# Altium schematic sheet RAMBo.SchDoc
size 553 x 388 mm; SheetNumber: 1
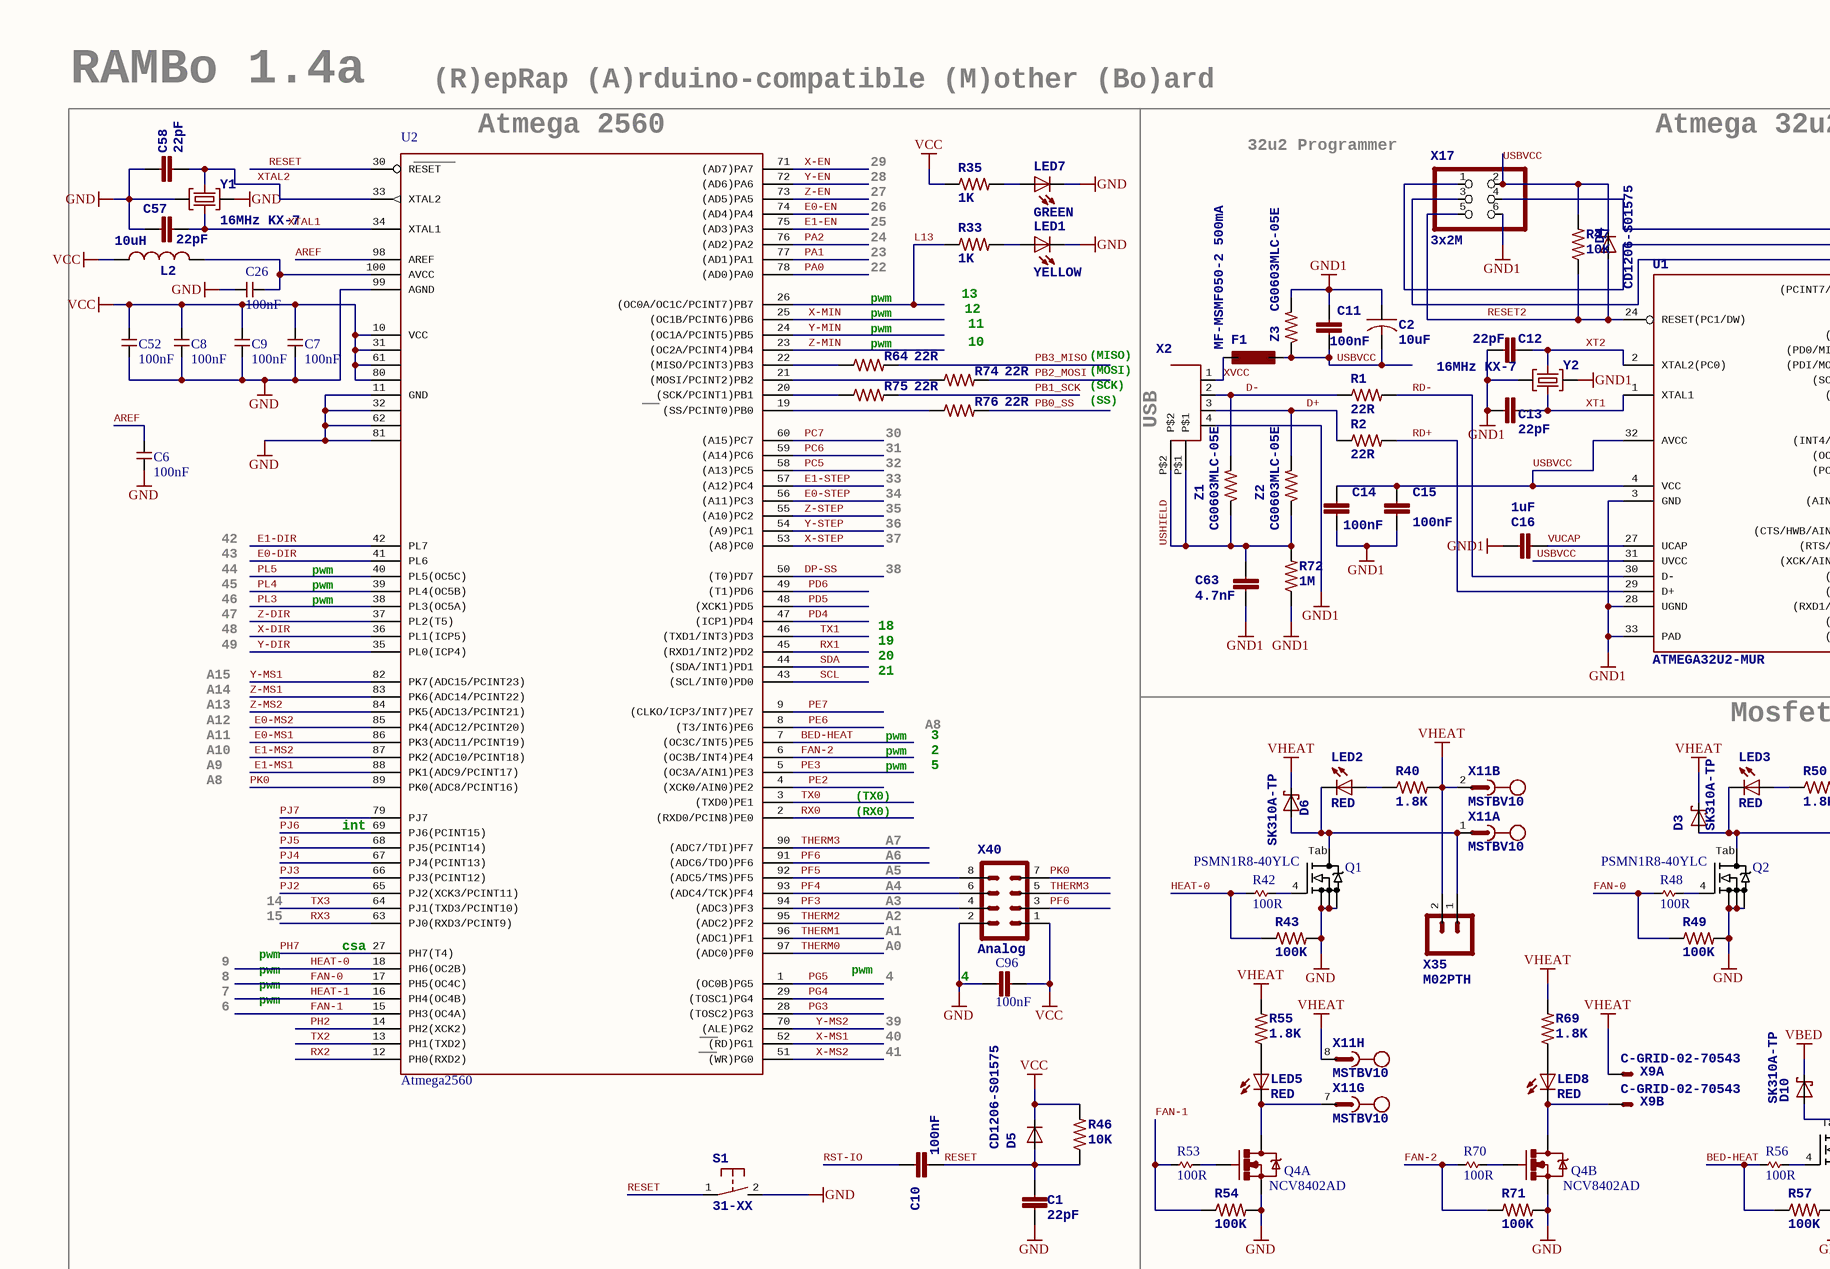
[diagram p0: RAMBo.SchDoc, top left]
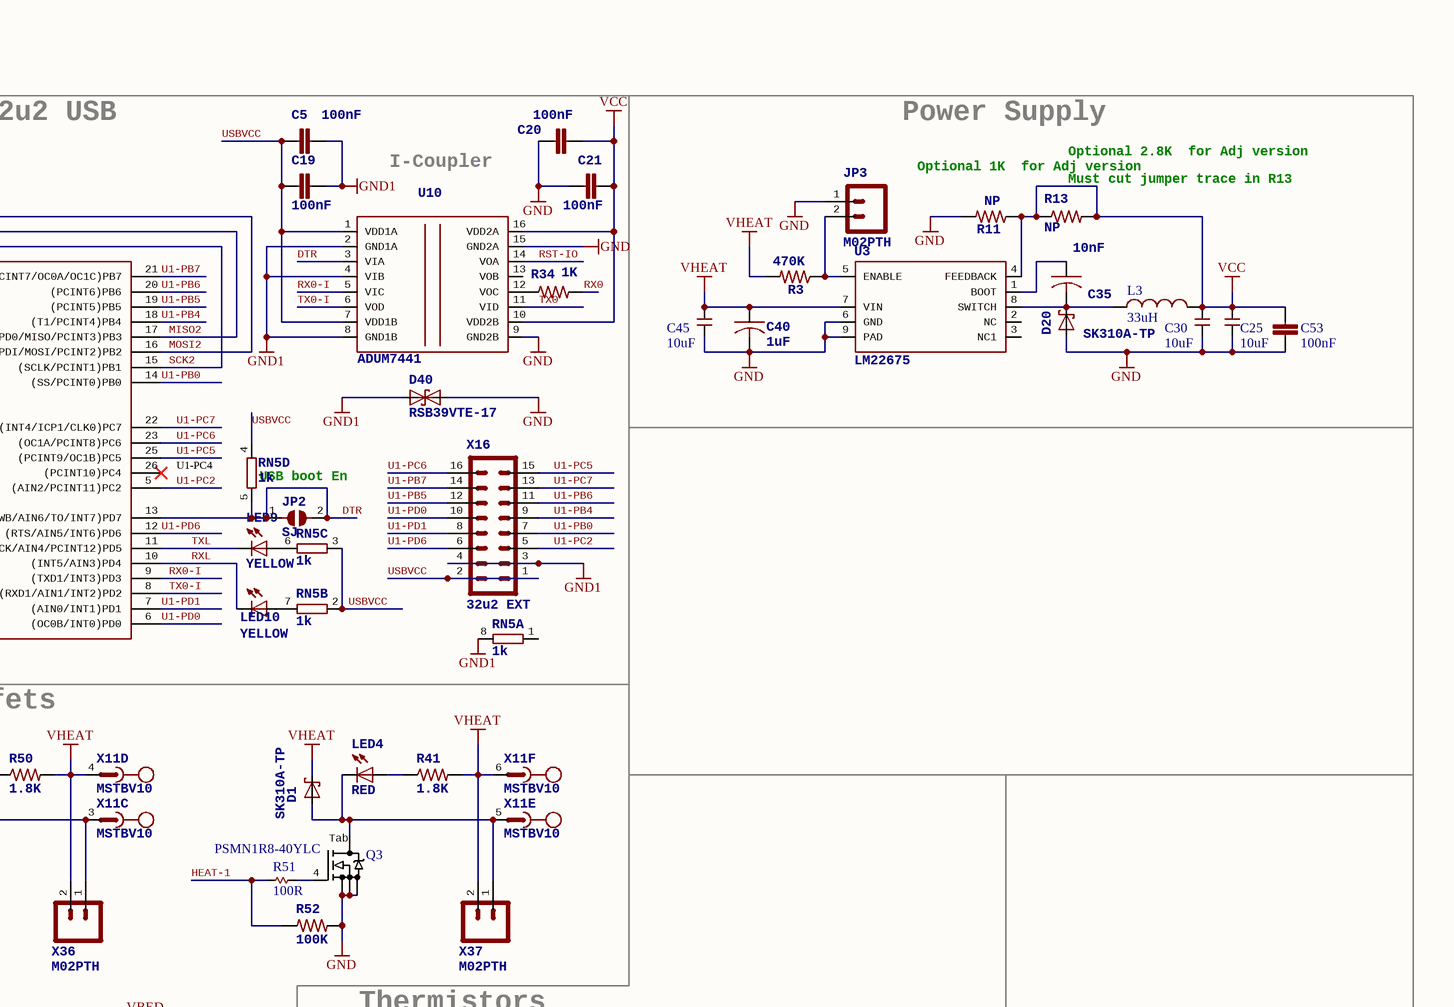
[diagram p1: RAMBo.SchDoc, top right]
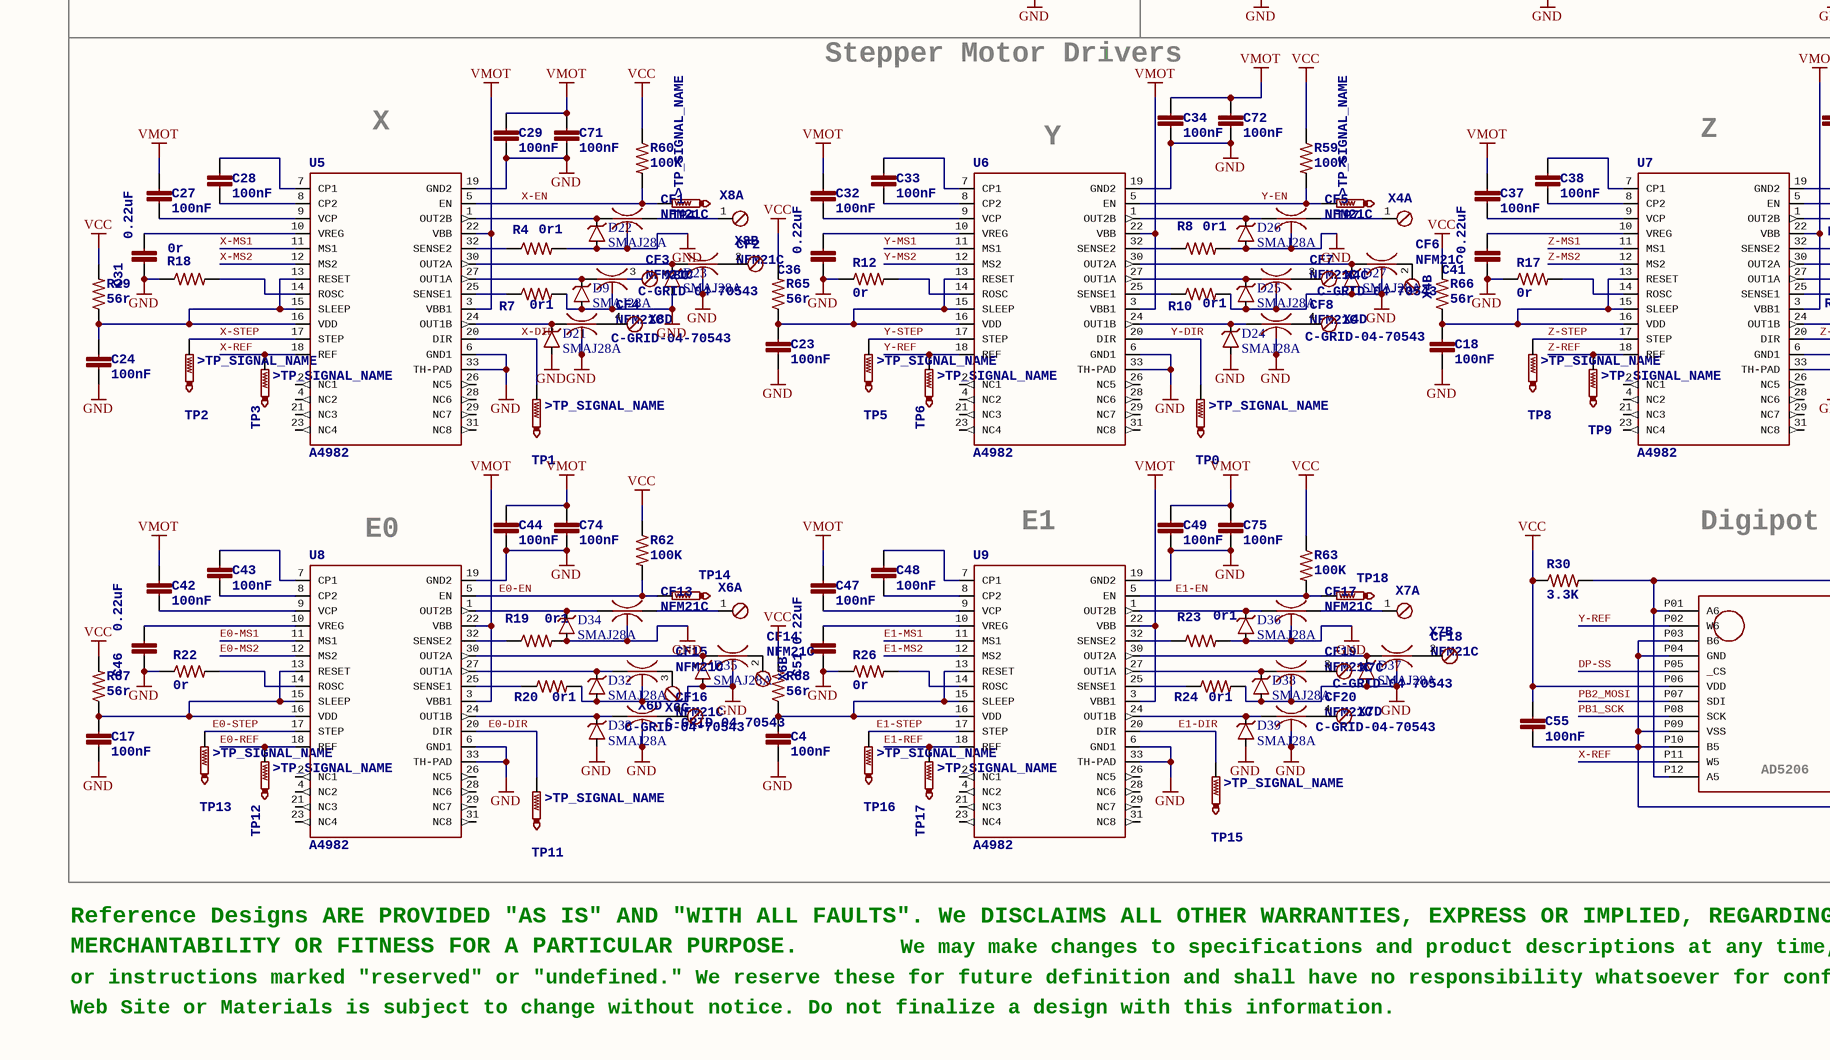
[diagram p2: RAMBo.SchDoc, bottom left]
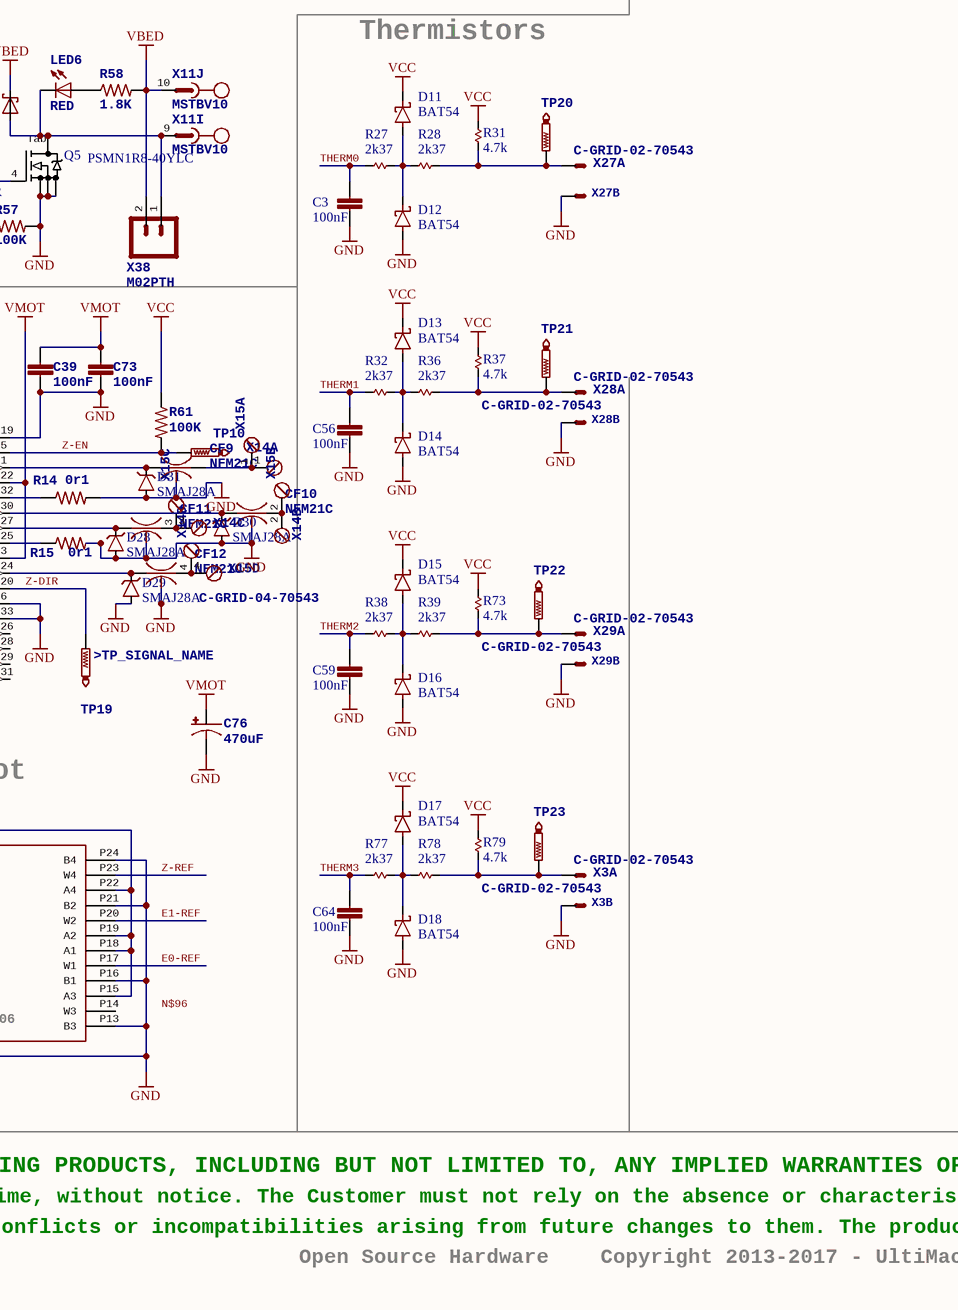
[diagram p3: RAMBo.SchDoc, bottom right]

## Parts
C1  22pF  [C0603]
C2  10uF  [C0805]
C3  100nF  [C0402]
C4  100nF  [C0603]
C5  100nF  [C0402]
C6  100nF  [C0402]
C7  100nF  [C0402]
C8  100nF  [C0402]
C9  100nF  [C0402]
C10  100nF  [C0603]
C11  100nF  [C0603]
C12  22pF  [C0603]
C13  22pF  [C0603]
C14  100nF  [C0603]
C15  100nF  [C0603]
C16  1uF  [C0603]
C17  100nF  [C0603]
C18  100nF  [C0603]
C19  100nF  [C0402]
C20  100nF  [C0402]
C21  100nF  [C0402]
C23  100nF  [C0603]
C24  100nF  [C0603]
C25  10uF  [C1206]
C26  100nF  [C0402]
C27  100nF  [C0603]
C28  100nF  [C0603]
C29  100nF  [C0603]
C30  10uF  [C1206]
C31  0.22uF  [C0603]
C32  100nF  [C0603]
C33  100nF  [C0603]
C34  100nF  [C0603]
C35  10nF  [C0603]
C36  0.22uF  [C0603]
C37  100nF  [C0603]
C38  100nF  [C0603]
C39  100nF  [C0603]
C40  1uF  [C0805]
C41  0.22uF  [C0603]
C42  100nF  [C0603]
C43  100nF  [C0603]
C44  100nF  [C0603]
C45  10uF  [C1206]
C46  0.22uF  [C0603]
C47  100nF  [C0603]
C48  100nF  [C0603]
C49  100nF  [C0603]
C51  0.22uF  [C0603]
C52  100nF  [C0402]
C53  100nF  [C0402]
C55  100nF  [C0603]
C56  100nF  [C0402]
C57  22pF  [C0603]
C58  22pF  [C0603]
C59  100nF  [C0402]
C63  4.7nF  [C0402]
C64  100nF  [C0402]
C71  100nF  [C0603]
C72  100nF  [C0603]
C73  100nF  [C0603]
C74  100nF  [C0603]
C75  100nF  [C0603]
C76  470uF  [C12,5-5]
C96  100nF  [C0402]
CF1  NFM21C  [NFM21C]
CF2  NFM21C  [NFM21C]
CF3  NFM21C  [NFM21C]
CF4  NFM21C  [NFM21C]
CF5  NFM21C  [NFM21C]
CF6  NFM21C  [NFM21C]
CF7  NFM21C  [NFM21C]
CF8  NFM21C  [NFM21C]
CF9  NFM21C  [NFM21C]
CF10  NFM21C  [NFM21C]
CF11  NFM21C  [NFM21C]
CF12  NFM21C  [NFM21C]
CF13  NFM21C  [NFM21C]
CF14  NFM21C  [NFM21C]
CF15  NFM21C  [NFM21C]
CF16  NFM21C  [NFM21C]
CF17  NFM21C  [NFM21C]
CF18  NFM21C  [NFM21C]
CF19  NFM21C  [NFM21C]
CF20  NFM21C  [NFM21C]
D1  SK310A-TP  [SMA-SM]
D3  SK310A-TP  [SMA-SM]
D4  CD1206-S01575  [MINIMELF]
D5  CD1206-S01575  [MINIMELF]
D6  SK310A-TP  [SMA-SM]
D9  SMAJ28A  [SMA-SM]
D10  SK310A-TP  [SMA-SM]
D11  BAT54  [SOD523_IPC]
D12  BAT54  [SOD523_IPC]
D13  BAT54  [SOD523_IPC]
D14  BAT54  [SOD523_IPC]
D15  BAT54  [SOD523_IPC]
D16  BAT54  [SOD523_IPC]
D17  BAT54  [SOD523_IPC]
D18  BAT54  [SOD523_IPC]
D20  SK310A-TP  [SMA-SM]
D21  SMAJ28A  [SMA-SM]
D22  SMAJ28A  [SMA-SM]
D23  SMAJ28A  [SMA-SM]
D24  SMAJ28A  [SMA-SM]
D25  SMAJ28A  [SMA-SM]
D26  SMAJ28A  [SMA-SM]
D27  SMAJ28A  [SMA-SM]
D28  SMAJ28A  [SMA-SM]
D29  SMAJ28A  [SMA-SM]
D30  SMAJ28A  [SMA-SM]
D31  SMAJ28A  [SMA-SM]
D32  SMAJ28A  [SMA-SM]
D33  SMAJ28A  [SMA-SM]
D34  SMAJ28A  [SMA-SM]
D35  SMAJ28A  [SMA-SM]
D36  SMAJ28A  [SMA-SM]
D37  SMAJ28A  [SMA-SM]
D38  SMAJ28A  [SMA-SM]
D39  SMAJ28A  [SMA-SM]
D40  RSB39VTE-17  [SOD323-R]
F1  MF-MSMF050-2 500mA  [L1812]
JP2  SJ  [SJ]
JP3  M02PTH  [1X02]
L2  10uH  [C0805]
L3  33uH  [INDP8080X40L]
LED1  YELLOW  [CHIP-LED0805]
LED2  RED  [CHIP-LED0805]
LED3  RED  [CHIP-LED0805]
LED4  RED  [CHIP-LED0805]
LED5  RED  [CHIP-LED0805]
LED6  RED  [CHIP-LED0805]
LED7  GREEN  [CHIP-LED0805]
LED8  RED  [CHIP-LED0805]
LED9  YELLOW  [CHIP-LED0805]
LED10  YELLOW  [CHIP-LED0805]
Q1  PSMN1R8-40YLC  [SOT669]
Q2  PSMN1R8-40YLC  [SOT669]
Q3  PSMN1R8-40YLC  [SOT669]
Q4  NCV8402AD  [NCV8402AD-SOIC8]  (parts A,B of 2)
Q5  PSMN1R8-40YLC  [SOT669]
R1  22R  [R0402]
R2  22R  [R0402]
R3  470K  [R0603]
R4  0r1  [R1206]
R7  0r1  [R1206]
R8  0r1  [R1206]
R10  0r1  [R1206]
R11  NP  [R0603]
R12  0r  [R0603]
R13  NP  [R0603]
R14  0r1  [R1206]
R15  0r1  [R1206]
R17  0r  [R0603]
R18  0r  [R0603]
R19  0r1  [R1206]
R20  0r1  [R1206]
R22  0r  [R0603]
R23  0r1  [R1206]
R24  0r1  [R1206]
R26  0r  [R0603]
R27  2k37  [R0402]
R28  2k37  [R0402]
R29  56r  [R0603]
R30  3.3K  [R0603]
R31  4.7k  [R0402]
R32  2k37  [R0402]
R33  1K  [R0603]
R34  1K  [R0603]
R35  1K  [R0603]
R36  2k37  [R0402]
R37  4.7k  [R0402]
R38  2k37  [R0402]
R39  2k37  [R0402]
R40  1.8K  [R0603]
R41  1.8K  [R0603]
R42  100R  [R0402]
R43  100K  [R0603]
R46  10K  [R0603]
R47  10K  [R0603]
R48  100R  [R0402]
R49  100K  [R0603]
R50  1.8K  [R0603]
R51  100R  [R0402]
R52  100K  [R0603]
R53  100R  [R0402]
R54  100K  [R0603]
R55  1.8K  [R0603]
R56  100R  [R0402]
R57  100K  [R0603]
R58  1.8K  [R0603]
R59  100K  [R0603]
R60  100K  [R0603]
R61  100K  [R0603]
R62  100K  [R0603]
R63  100K  [R0603]
R64  22R  [R0402]
R65  56r  [R0603]
R66  56r  [R0603]
R67  56r  [R0603]
R68  56r  [R0603]
R69  1.8K  [R0603]
R70  100R  [R0402]
R71  100K  [R0603]
R72  1M  [R0402]
R73  4.7k  [R0402]
R74  22R  [R0402]
R75  22R  [R0402]
R76  22R  [R0402]
R77  2k37  [R0402]
R78  2k37  [R0402]
R79  4.7k  [R0402]
RN5  1k  [CAY16]  (parts A,B,C,D of 4)
S1  31-XX  [B3F-31XX]
TP0  TP_SIGNAL_NAME: >TP_SIGNAL_NAME  [B1,27TH]  (hidden comment: PTR1B1,27TH)
TP1  TP_SIGNAL_NAME: >TP_SIGNAL_NAME  [B1,27TH]  (hidden comment: PTR1B1,27TH)
TP2  TP_SIGNAL_NAME: >TP_SIGNAL_NAME  [B1,27TH]  (hidden comment: PTR1B1,27TH)
TP3  TP_SIGNAL_NAME: >TP_SIGNAL_NAME  [B1,27TH]  (hidden comment: PTR1B1,27TH)
TP4  TP_SIGNAL_NAME: >TP_SIGNAL_NAME  [B1,27TH]  (hidden comment: PTR1B1,27TH)
TP5  TP_SIGNAL_NAME: >TP_SIGNAL_NAME  [B1,27TH]  (hidden comment: PTR1B1,27TH)
TP6  TP_SIGNAL_NAME: >TP_SIGNAL_NAME  [B1,27TH]  (hidden comment: PTR1B1,27TH)
TP7  TP_SIGNAL_NAME: >TP_SIGNAL_NAME  [B1,27TH]  (hidden comment: PTR1B1,27TH)
TP8  TP_SIGNAL_NAME: >TP_SIGNAL_NAME  [B1,27TH]  (hidden comment: PTR1B1,27TH)
TP9  TP_SIGNAL_NAME: >TP_SIGNAL_NAME  [B1,27TH]  (hidden comment: PTR1B1,27TH)
TP10  PTR1B1,27TH  [B1,27TH]  (value not drawn)
TP11  TP_SIGNAL_NAME: >TP_SIGNAL_NAME  [B1,27TH]  (hidden comment: PTR1B1,27TH)
TP12  TP_SIGNAL_NAME: >TP_SIGNAL_NAME  [B1,27TH]  (hidden comment: PTR1B1,27TH)
TP13  TP_SIGNAL_NAME: >TP_SIGNAL_NAME  [B1,27TH]  (hidden comment: PTR1B1,27TH)
TP14  PTR1B1,27TH  [B1,27TH]  (value not drawn)
TP15  TP_SIGNAL_NAME: >TP_SIGNAL_NAME  [B1,27TH]  (hidden comment: PTR1B1,27TH)
TP16  TP_SIGNAL_NAME: >TP_SIGNAL_NAME  [B1,27TH]  (hidden comment: PTR1B1,27TH)
TP17  TP_SIGNAL_NAME: >TP_SIGNAL_NAME  [B1,27TH]  (hidden comment: PTR1B1,27TH)
TP18  PTR1B1,27TH  [B1,27TH]  (value not drawn)
TP19  TP_SIGNAL_NAME: >TP_SIGNAL_NAME  [B1,27TH]  (hidden comment: PTR1B1,27TH)
TP20  PTR1B1,27  [B1,27]  (value not drawn)
TP21  PTR1B1,27  [B1,27]  (value not drawn)
TP22  PTR1B1,27  [B1,27]  (value not drawn)
TP23  PTR1B1,27  [B1,27]  (value not drawn)
U1  ATMEGA32U2-MUR  [QFN32TROUND]
U2  Atmega2560  [TSQFP50P1600X1600X120-100L]
U3  LM22675  [SOIC127P600X170-9N]
U4  AD5206  [TSSOP24]  (value not drawn)
U5  A4982  [QFN50P500X500X100_HS-33L]
U6  A4982  [QFN50P500X500X100_HS-33L]
U7  A4982  [QFN50P500X500X100_HS-33L]
U8  A4982  [QFN50P500X500X100_HS-33L]
U9  A4982  [QFN50P500X500X100_HS-33L]
U10  ADUM7441  [QSOP16]
X2  USB B-TH  [PN61729]  (value not drawn)
X3  C-GRID-02-70543  [70543-02]  (parts A,B of 2)
X4  C-GRID-04-70543  [4POL254]  (value not drawn)  (parts A,B,C,D of 4)
X6  C-GRID-04-70543  [4POL254]  (value not drawn)  (parts A,B,C,D of 4)
X7  C-GRID-04-70543  [4POL254]  (value not drawn)  (parts A,B,C,D of 4)
X8  C-GRID-04-70543  [4POL254]  (value not drawn)  (parts A,B,C,D of 4)
X9  C-GRID-02-70543  [70543-02]  (parts A,B of 2)
X11  MSTBV10  [MSTBV10]  (parts A,B,C,D,E,F,G,H,I,J of 10)
X14  C-GRID-04-70543  [4POL254]  (value not drawn)  (parts A,B,C,D of 4)
X15  C-GRID-04-70543  [4POL254]  (value not drawn)  (parts A,B,C,D of 4)
X16  32u2 EXT  [2X8]
X17  3x2M  [2X03]
X27  C-GRID-02-70543  [70543-02]  (parts A,B of 2)
X28  C-GRID-02-70543  [70543-02]  (parts A,B of 2)
X29  C-GRID-02-70543  [70543-02]  (parts A,B of 2)
X35  M02PTH  [1X02]
X36  M02PTH  [1X02]
X37  M02PTH  [1X02]
X38  M02PTH  [1X02]
X40  Analog  [2X4]
Y1  16MHz KX-7  [CRYSTAL-3.2-2.5]
Y2  16MHz KX-7  [CRYSTAL-3.2-2.5]
Z1  CG0603MLC-05E  [R0603]
Z2  CG0603MLC-05E  [R0603]
Z3  CG0603MLC-05E  [R0603]

## Nets
GND: C1.2 C3.2 C4.2 C6.2 C7.2 C8.2 C9.2 C17.2 C18.2 C20.2 C21.1 C23.2 C24.2 C25.1 C26.2 C29.2 C30.1 C31.1 C34.2 C36.1 C39.2 C40.2 C41.1 C44.2 C45.1 C46.1 C49.2 C51.1 C52.2 C53.2 C55.2 C56.2 C57.2 C58.2 C59.2 C64.2 C71.2 C72.2 C73.2 C74.2 C75.2 C76.- C96.1 CF1.2@1 CF1.2@2 CF2.2@1 CF2.2@2 CF3.2@1 CF3.2@2 CF4.2@1 CF4.2@2 CF5.2@1 CF5.2@2 CF6.2@1 CF6.2@2 CF7.2@1 CF7.2@2 CF8.2@1 CF8.2@2 CF9.2@1 CF9.2@2 CF10.2@1 CF10.2@2 CF11.2@1 CF11.2@2 CF12.2@1 CF12.2@2 CF13.2@1 CF13.2@2 CF14.2@1 CF14.2@2 CF15.2@1 CF15.2@2 CF16.2@1 CF16.2@2 CF17.2@1 CF17.2@2 CF18.2@1 CF18.2@2 CF19.2@1 CF19.2@2 CF20.2@1 CF20.2@2 D9.A D12.A D14.A D16.A D18.A D20.A D21.A D22.A D23.A D24.A D25.A D26.A D27.A D28.A D29.A D30.A D31.A D32.A D33.A D34.A D35.A D36.A D37.A D38.A D39.A D40.C JP3.1 LED1.C LED7.C Q1.1(S) Q1.2(S) Q1.3(S) Q2.1(S) Q2.2(S) Q2.3(S) Q3.1(S) Q3.2(S) Q3.3(S) Q4.1(S) Q4.3(S) Q5.1(S) Q5.2(S) Q5.3(S) R4.2 R7.2 R8.2 R10.2 R11.2 R12.1 R14.2 R15.2 R17.1 R18.1 R19.2 R20.2 R22.1 R23.2 R24.2 R26.1 R43.2 R49.2 R52.2 R54.2 R57.2 R71.2 S1.2(S) U2.11(GND) U2.32(GND1) U2.62(GND2) U2.81(GND3) U2.99(AGND) U3.6(GND) U3.9(PAD) U4.P03(B6) U4.P04(GND) U4.P09(VSS) U4.P10(B5) U4.P13(B3) U4.P16(B1) U4.P21(B2) U4.P24(B4) U5.6(GND1) U5.19(GND2) U5.33(TH-PAD) U6.6(GND1) U6.19(GND2) U6.33(TH-PAD) U7.6(GND1) U7.19(GND2) U7.33(TH-PAD) U8.6(GND1) U8.19(GND2) U8.33(TH-PAD) U9.6(GND1) U9.19(GND2) U9.33(TH-PAD) U10.9(GND2B) U10.15(GND2A) X3.1(S) X27.1(S) X28.1(S) X29.1(S) X40.2 Y1.2(GND) Y1.4(GND)
GND1: C2.1 C5.2 C11.2 C12.2 C13.2 C14.2 C15.2 C16.2 C19.2 C63.2 D40.A R72.1 RN5.8 U1.3(GND) U1.28(UGND) U1.33(PAD) U10.2(GND1A) U10.4(VIB) U10.8(GND1B) X2.4 X16.3 X16.4 X17.6 Y2.2(GND) Y2.4(GND) Z3.2
VBED: D10.C R58.2 X11.10 X38.2
VCC: C7.1 C8.1 C9.1 C20.1 C21.2 C25.2 C30.2 C52.1 C53.1 C55.1 C96.2 D5.C D11.K D13.K D15.K D17.K L2.1 L3.2 R11.1 R13.1 R13.2 R29.2 R30.1 R31.2 R35.1 R37.2 R46.2 R59.1 R60.1 R61.1 R62.1 R63.1 R65.2 R66.2 R67.2 R68.2 R73.2 R79.2 U2.10(VCC) U2.31(VCC1) U2.61(VCC2) U2.80(VCC3) U3.4(FEEDBACK) U4.P06(VDD) U10.10(VDD2B) U10.16(VDD2A) X40.1
VHEAT: C40.1 C45.2 D1.C D3.C D6.C R3.2 R40.2 R41.2 R50.2 R55.2 R69.2 U3.7(VIN) X9.2(S) X11.2 X11.4 X11.6 X11.8 X35.2 X36.2 X37.2
VMOT: C27.1 C29.1 C32.1 C34.1 C37.1 C39.1 C42.1 C44.1 C47.1 C49.1 C71.1 C72.1 C73.1 C74.1 C75.1 C76.+ U5.3(VBB1) U5.22(VBB) U6.3(VBB1) U6.22(VBB) U7.3(VBB1) U7.22(VBB) U8.3(VBB1) U8.22(VBB) U9.3(VBB1) U9.22(VBB)
AREF: C6.1 U2.98(AREF)
BED-HEAT: R56.1 R57.1 U2.7((OC3C/INT5)PE5)
D+: R2.1 X2.3 Z2.2
D-: R1.1 X2.2 Z1.2
DP-SS: U2.50((T0)PD7) U4.P05(_CS)
DTR: JP2.1 JP2.2 RN5.5 U1.13((CTS/HWB/AIN6/TO/INT7)PD7) U10.3(VIA)
E0-DIR: TP11.TP U2.41(PL6) U8.20(DIR)
E0-EN: R62.2 TP14.TP U2.74((AD4)PA4) U8.5(EN)
E0-MS1: U2.86(PK3(ADC11/PCINT19)) U8.11(MS1)
E0-MS2: U2.85(PK4(ADC12/PCINT20)) U8.12(MS2)
E0-REF: TP12.TP U4.P17(W1) U8.18(REF)
E0-STEP: TP13.TP U2.56((A11)PC3) U8.17(STEP)
E1-DIR: TP15.TP U2.42(PL7) U9.20(DIR)
E1-EN: R63.2 TP18.TP U2.75((AD3)PA3) U9.5(EN)
E1-MS1: U2.88(PK1(ADC9/PCINT17)) U9.11(MS1)
E1-MS2: U2.87(PK2(ADC10/PCINT18)) U9.12(MS2)
E1-REF: TP17.TP U4.P20(W2) U9.18(REF)
E1-STEP: TP16.TP U2.57((A12)PC4) U9.17(STEP)
FAN-0: R48.1 R49.1 U2.17(PH5(OC4C))
FAN-1: R53.1 R54.1 U2.15(PH3(OC4A))
FAN-2: R70.1 R71.1 U2.6((OC3B/INT4)PE4)
HEAT-0: R42.1 R43.1 U2.18(PH6(OC2B))
HEAT-1: R51.1 R52.1 U2.16(PH4(OC4B))
L13: R33.1 U2.26((OC0A/OC1C/PCINT7)PB7)
MISO2: U1.17((PD0/MISO/PCINT3)PB3) X17.1
MOSI2: U1.16((PDI/MOSI/PCINT2)PB2) X17.4
PA0: U2.78((AD0)PA0)
PA1: U2.77((AD1)PA1)
PA2: U2.76((AD2)PA2)
PB0_SS: R76.2
PB1_SCK: R75.2 U4.P08(SCK)
PB2_MOSI: R74.2 U4.P07(SDI)
PB3_MISO: R64.2
PC5: U2.58((A13)PC5)
PC6: U2.59((A14)PC6)
PC7: U2.60((A15)PC7)
PD4: U2.47((ICP1)PD4)
PD5: U2.48((XCK1)PD5)
PD6: U2.49((T1)PD6)
PE2: U2.4((XCK0/AIN0)PE2)
PE3: U2.5((OC3A/AIN1)PE3)
PE6: U2.8((T3/INT6)PE6)
PE7: U2.9((CLKO/ICP3/INT7)PE7)
PF3: U2.94((ADC3)PF3) X40.4
PF4: U2.93((ADC4/TCK)PF4) X40.6
PF5: U2.92((ADC5/TMS)PF5) X40.8
PF6: U2.91((ADC6/TDO)PF6) X40.3
PG3: U2.28((TOSC2)PG3)
PG4: U2.29((TOSC1)PG4)
PG5: U2.1((OC0B)PG5)
PH2: U2.14(PH2(XCK2))
PH7: U2.27(PH7(T4))
PJ2: U2.65(PJ2(XCK3/PCINT11))
PJ3: U2.66(PJ3(PCINT12))
PJ4: U2.67(PJ4(PCINT13))
PJ5: U2.68(PJ5(PCINT14))
PJ6: U2.69(PJ6(PCINT15))
PJ7: U2.79(PJ7)
PK0: U2.89(PK0(ADC8/PCINT16)) X40.7
PL3: U2.38(PL3(OC5A))
PL4: U2.39(PL4(OC5B))
PL5: U2.40(PL5(OC5C))
RD+: R2.2 U1.29(D+)
RD-: R1.2 U1.30(D-)
RESET: C1.1 C10.2 D5.A R46.1 S1.1(P) U2.30(RESET)
RESET2: D4.A R47.1 U1.24(RESET(PC1/DW)) X17.5
RST-IO: C10.1 U10.14(VOA)
RX0: R34.2 U2.2((RXD0/PCIN8)PE0)
RX0-I: U1.9((TXD1/INT3)PD3) U10.5(VIC)
RX1: U2.45((RXD1/INT2)PD2)
RX2: U2.12(PH0(RXD2))
RX3: U2.63(PJ0(RXD3/PCINT9))
RXL: LED10.C U1.10((INT5/AIN3)PD4)
SCK2: U1.15((SCLK/PCINT1)PB1) X17.3
SCL: U2.43((SCL/INT0)PD0)
SDA: U2.44((SDA/INT1)PD1)
THERM0: C3.1 R27.2 U2.97((ADC0)PF0)
THERM1: C56.1 R32.2 U2.96((ADC1)PF1)
THERM2: C59.1 R38.2 U2.95((ADC2)PF2)
THERM3: C64.1 R77.2 U2.90((ADC7/TDI)PF7) X40.5
TX0: U2.3((TXD0)PE1) U10.11(VID)
TX0-I: U1.8((RXD1/AIN1/INT2)PD2) U10.6(VOD)
TX1: U2.46((TXD1/INT3)PD3)
TX2: U2.13(PH1(TXD2))
TX3: U2.64(PJ1(TXD3/PCINT10))
TXL: LED9.C U1.11((XCK/AIN4/PCINT12)PD5)
U1-PB0: U1.14((SS/PCINT0)PB0) X16.7
U1-PB4: U1.18((T1/PCINT4)PB4) X16.9
U1-PB5: U1.19((PCINT5)PB5) X16.12
U1-PB6: U1.20((PCINT6)PB6) X16.11
U1-PB7: U1.21((PCINT7/OC0A/OC1C)PB7) X16.14
U1-PC2: U1.5((AIN2/PCINT11)PC2) X16.5
U1-PC5: U1.25((PCINT9/OC1B)PC5) X16.15
U1-PC6: U1.23((OC1A/PCINT8)PC6) X16.16
U1-PC7: U1.22((INT4/ICP1/CLK0)PC7) X16.13
U1-PD0: U1.6((OC0B/INT0)PD0) X16.10
U1-PD1: U1.7((AIN0/INT1)PD1) X16.8
U1-PD6: U1.12((RTS/AIN5/INT6)PD6) X16.6
USBVCC: C2.2 C5.1 C11.1 C14.1 C15.1 C19.1 D4.C F1.1 R47.2 RN5.2 RN5.3 RN5.4 U1.4(VCC) U1.31(UVCC) U1.32(AVCC) U10.1(VDD1A) U10.7(VDD1B) X16.1 X16.2 X17.2 Z3.1
USHIELD: C63.1 R72.2 X2.P$1 X2.P$2 Z1.1 Z2.1
VUCAP: C16.1 U1.27(UCAP)
X-DIR: TP1.TP U2.36(PL1(ICP5)) U5.20(DIR)
X-EN: R60.2 TP4.TP U2.71((AD7)PA7) U5.5(EN)
X-MIN: U2.25((OC1B/PCINT6)PB6)
X-MS1: U2.52((RD)PG1) U5.11(MS1)
X-MS2: U2.51((WR)PG0) U5.12(MS2)
X-REF: TP3.TP U4.P11(W5) U5.18(REF)
X-STEP: TP2.TP U2.53((A8)PC0) U5.17(STEP)
XT1: C13.1 U1.1(XTAL1) Y2.1(C1)
XT2: C12.1 U1.2(XTAL2(PC0)) Y2.3(C2)
XTAL1: C57.1 U2.34(XTAL1) Y1.1(C1)
XTAL2: C58.1 U2.33(XTAL2) Y1.3(C2)
XVCC: F1.2 X2.1
Y-DIR: TP0.TP U2.35(PL0(ICP4)) U6.20(DIR)
Y-EN: R59.2 TP7.TP U2.72((AD6)PA6) U6.5(EN)
Y-MIN: U2.24((OC1A/PCINT5)PB5)
Y-MS1: U2.82(PK7(ADC15/PCINT23)) U6.11(MS1)
Y-MS2: U2.70((ALE)PG2) U6.12(MS2)
Y-REF: TP6.TP U4.P02(W6) U6.18(REF)
Y-STEP: TP5.TP U2.54((A9)PC1) U6.17(STEP)
Z-DIR: TP19.TP U2.37(PL2(T5)) U7.20(DIR)
Z-EN: R61.2 TP10.TP U2.73((AD5)PA5) U7.5(EN)
Z-MIN: U2.23((OC2A/PCINT4)PB4)
Z-MS1: U2.83(PK6(ADC14/PCINT22)) U7.11(MS1)
Z-MS2: U2.84(PK5(ADC13/PCINT21)) U7.12(MS2)
Z-REF: TP9.TP U4.P23(W4) U7.18(REF)
Z-STEP: TP8.TP U2.55((A10)PC2) U7.17(STEP)
NetC4_1: C4.1 R68.1 U9.13(RESET) U9.15(SLEEP) U9.16(VDD)
NetC17_1: C17.1 R67.1 U8.13(RESET) U8.15(SLEEP) U8.16(VDD)
NetC18_1: C18.1 R66.1 U7.13(RESET) U7.15(SLEEP) U7.16(VDD)
NetC23_1: C23.1 R65.1 U6.13(RESET) U6.15(SLEEP) U6.16(VDD)
NetC24_1: C24.1 R29.1 U5.13(RESET) U5.15(SLEEP) U5.16(VDD)
NetC26_1: C26.1 L2.2 U2.100(AVCC)
NetC27_2: C27.2 U5.9(VCP)
NetC28_1: C28.1 U5.7(CP1)
NetC28_2: C28.2 U5.8(CP2)
NetC31_2: C31.2 U5.10(VREG)
NetC32_2: C32.2 U6.9(VCP)
NetC33_1: C33.1 U6.7(CP1)
NetC33_2: C33.2 U6.8(CP2)
NetC35_1: C35.1 U3.1(BOOT)
NetC35_2: C35.2 D20.C L3.1 U3.8(SWITCH)
NetC36_2: C36.2 U6.10(VREG)
NetC37_2: C37.2 U7.9(VCP)
NetC38_1: C38.1 U7.7(CP1)
NetC38_2: C38.2 U7.8(CP2)
NetC41_2: C41.2 U7.10(VREG)
NetC42_2: C42.2 U8.9(VCP)
NetC43_1: C43.1 U8.7(CP1)
NetC43_2: C43.2 U8.8(CP2)
NetC46_2: C46.2 U8.10(VREG)
NetC47_2: C47.2 U9.9(VCP)
NetC48_1: C48.1 U9.7(CP1)
NetC48_2: C48.2 U9.8(CP2)
NetC51_2: C51.2 U9.10(VREG)
NetCF1_1: CF1.1 D22.K U5.1(OUT2B)
NetCF1_3: CF1.3 X8.1
NetCF2_1: CF2.1 D23.K U5.30(OUT2A)
NetCF2_3: CF2.3 X8.2
NetCF3_1: CF3.1 D9.K U5.27(OUT1A)
NetCF3_3: CF3.3 X8.3
NetCF4_1: CF4.1 D21.K U5.24(OUT1B)
NetCF4_3: CF4.3 X8.4
NetCF5_1: CF5.1 D26.K U6.1(OUT2B)
NetCF5_3: CF5.3 X4.1
NetCF6_1: CF6.1 D27.K U6.30(OUT2A)
NetCF6_3: CF6.3 X4.2
NetCF7_1: CF7.1 D25.K U6.27(OUT1A)
NetCF7_3: CF7.3 X4.3
NetCF8_1: CF8.1 D24.K U6.24(OUT1B)
NetCF8_3: CF8.3 X4.4
NetCF9_1: CF9.1 D31.K U7.1(OUT2B)
NetCF9_3: CF9.3 X14.1 X15.1
NetCF10_1: CF10.1 D30.K U7.30(OUT2A)
NetCF10_3: CF10.3 X14.2 X15.2
NetCF11_1: CF11.1 D28.K U7.27(OUT1A)
NetCF11_3: CF11.3 X14.3 X15.3
NetCF12_1: CF12.1 D29.K U7.24(OUT1B)
NetCF12_3: CF12.3 X14.4 X15.4
NetCF13_1: CF13.1 D34.K U8.1(OUT2B)
NetCF13_3: CF13.3 X6.1
NetCF14_1: CF14.1 D35.K U8.30(OUT2A)
NetCF14_3: CF14.3 X6.2
NetCF15_1: CF15.1 D32.K U8.27(OUT1A)
NetCF15_3: CF15.3 X6.3
NetCF16_1: CF16.1 D33.K U8.24(OUT1B)
NetCF16_3: CF16.3 X6.4
NetCF17_1: CF17.1 D36.K U9.1(OUT2B)
NetCF17_3: CF17.3 X7.1
NetCF18_1: CF18.1 D37.K U9.30(OUT2A)
NetCF18_3: CF18.3 X7.2
NetCF19_1: CF19.1 D38.K U9.27(OUT1A)
NetCF19_3: CF19.3 X7.3
NetCF20_1: CF20.1 D39.K U9.24(OUT1B)
NetCF20_3: CF20.3 X7.4
NetD1_A: D1.A LED4.C Q3.MB(D) X11.5 X37.1
NetD3_A: D3.A LED3.C Q2.MB(D) X11.3 X36.1
NetD6_A: D6.A LED2.C Q1.MB(D) X11.1 X35.1
NetD10_A: D10.A LED6.C Q5.MB(D) X11.9 X38.1
NetD11_A: D11.A D12.K R27.1 R28.2
NetD13_A: D13.A D14.K R32.1 R36.2
NetD15_A: D15.A D16.K R38.1 R39.2
NetD17_A: D17.A D18.K R77.1 R78.2
NetJP3_2: JP3.2 R3.1 U3.5(ENABLE)
NetLED1_A: LED1.A R33.2
NetLED2_A: LED2.A R40.1
NetLED3_A: LED3.A R50.1
NetLED4_A: LED4.A R41.1
NetLED5_A: LED5.A R55.1
NetLED5_C: LED5.C Q4.7(D) X11.7
NetLED6_A: LED6.A R58.1
NetLED7_A: LED7.A R35.2
NetLED8_A: LED8.A R69.1
NetLED8_C: LED8.C Q4.5(D) X9.1(S)
NetLED9_A: LED9.A RN5.6
NetLED10_A: LED10.A RN5.7
NetQ1_4: Q1.4(G) R42.2
NetQ2_4: Q2.4(G) R48.2
NetQ3_4: Q3.4(G) R51.2
NetQ4_2: Q4.2(G) R53.2
NetQ4_4: Q4.4(G) R70.2
NetQ5_4: Q5.4(G) R56.2
NetR4_1: R4.1 U5.32(SENSE2)
NetR7_1: R7.1 U5.25(SENSE1)
NetR8_1: R8.1 U6.32(SENSE2)
NetR10_1: R10.1 U6.25(SENSE1)
NetR12_2: R12.2 U6.14(ROSC)
NetR14_1: R14.1 U7.32(SENSE2)
NetR15_1: R15.1 U7.25(SENSE1)
NetR17_2: R17.2 U7.14(ROSC)
NetR18_2: R18.2 U5.14(ROSC)
NetR19_1: R19.1 U8.32(SENSE2)
NetR20_1: R20.1 U8.25(SENSE1)
NetR22_2: R22.2 U8.14(ROSC)
NetR23_1: R23.1 U9.32(SENSE2)
NetR24_1: R24.1 U9.25(SENSE1)
NetR26_2: R26.2 U9.14(ROSC)
NetR28_1: R28.1 R31.1 TP20.TP X27.2(S)
NetR30_2: R30.2 U4.P01(A6) U4.P12(A5) U4.P15(A3) U4.P18(A1) U4.P19(A2) U4.P22(A4)
NetR34_1: R34.1 U10.12(VOC)
NetR36_1: R36.1 R37.1 TP21.TP X28.2(S)
NetR39_1: R39.1 R73.1 TP22.TP X29.2(S)
NetR64_1: R64.1 U2.22((MISO/PCINT3)PB3)
NetR74_1: R74.1 U2.21((MOSI/PCINT2)PB2)
NetR75_1: R75.1 U2.20((SCK/PCINT1)PB1)
NetR76_1: R76.1 U2.19((SS/PCINT0)PB0)
NetR78_1: R78.1 R79.1 TP23.TP X3.2(S)

Not connected (* = marked no-connect by the designer): RN5 1; U1 26((PCINT10)PC4)*; U3 2(NC) 3(NC1); U4 P14(W3); U5 2(NC1) 4(NC2) 21(NC3) 23(NC4) 26(NC5) 28(NC6) 29(NC7) 31(NC8); U6 2(NC1) 4(NC2) 21(NC3) 23(NC4) 26(NC5) 28(NC6) 29(NC7) 31(NC8); U7 2(NC1) 4(NC2) 21(NC3) 23(NC4) 26(NC5) 28(NC6) 29(NC7) 31(NC8); U8 2(NC1) 4(NC2) 21(NC3) 23(NC4) 26(NC5) 28(NC6) 29(NC7) 31(NC8); U9 2(NC1) 4(NC2) 21(NC3) 23(NC4) 26(NC5) 28(NC6) 29(NC7) 31(NC8); U10 13(VOB)

## Notes on the sheet
- RAMBo 1.4a
- (R)epRap (A)rduino-compatible (M)other (Bo)ard
- (near U2) Atmega 2560
- 29
- 32u2 Programmer
- Atmega 32u2 USB
- Power Supply
- Optional 2.8K
  for Adj version
- 24
- 25
- 26
- 27
- 28
- I-Coupler
- Optional 1K
  for Adj version
- (near R13) Must cut jumper trace in R13
- pwm
- (near R64) pwm
- 22
- 23
- (near R33) 13
- 12
- (near R74) 10
- 11
- (near X2) (MISO)
- (near X2) (SCK)
- (near X2) (MOSI)
- 30
- 31
- 32
- (near X2) (SS)
- (near X2) USB
- 42
- 33
- 34
- 35
- 36
- 37
- U1-PC4
- (near RN5) USB boot En
- 43
- 44
- 45
- 46
- 47
- 38
- A14
- A15
- 48
- 49
- 18
- 19
- 20
- 21
- A9
- A10
- A11
- A12
- A13
- A8
- 2
- 3
- 5
- Mosfets
- (near U2) int
- (TX0)
- (RX0)
- A7
- 15
- 14
- A6
- A5
- A4
- A3
- A2
- 7
- 8
- 9
- (near U2) csa
- 4
- A1
- A0
- (near C96) 4
- 6
- 39
- 40
- 41
- Thermistors
- Stepper Motor Drivers
- (near U5) X
- (near U7) Z
- (near U6) Y
- (near U8) E0
- (near U9) E1
- Digipot
- (near U4) AD5206
- Reference Designs ARE PROVIDED "AS IS" AND "WITH ALL FAULTS". We DISCLAIMS ALL OTHER WARRANTIES, EXPRESS OR IMPLIED, REGARDING PRODUCTS, INCLUDING BUT NOT LIMITED TO, ANY IMPLIED WARRANTIES OF
- MERCHANTABILITY OR FITNESS FOR A PARTICULAR PURPOSE.
- We may make changes to specifications and product descriptions at any time, without notice. The Customer must not rely on the absence or characteristics of any features
- or instructions marked "reserved" or "undefined." We reserve these for future definition and shall have no responsibility whatsoever for conflicts or incompatibilities arising from future changes to them. The product information on the
- Web Site or Materials is subject to change without notice. Do not finalize a design with this information.
- Open Source Hardware
- Copyright 2013-2017 - UltiMachine
- Labels drawn without touching a wire or pin: N$96
- (in symbol PSMN1R8-40YLC) Tab

## Library data of the parts
C1 C12 C13 C57 C58 = C-EUC0603: CAPACITOR, European symbol; MANUFACTURER #: C1608C0G1H220J; Manufacturer: TDK; EE_SPEC: 22pF 50V capacitor
C2 = C-USC0805: CAPACITOR, American symbol; MANUFACTURER #: C0805C106K8PACTU; Manufacturer: Kemet; EE_SPEC: 10uF
C3 C53 C56 C59 C64 C96 = GRM155R71C104KA88D: CAP CER 0402 100nF 16V 10% X7R; Manufacturer: Murata; Part Description: 0.10µF ±10% 16V Ceramic Capacitor X7R 0402 (1005 Metric); EE_SPEC: 100nF 16V X7R 0402; Tolerance: +/- 10%; VALUE: 100nF; MANUFACTURER #: GRM155R71C104KA88D; DISTRIBUTOR #: 490-3261-2-ND; DISTRIBUTOR: Digi-Key; PART: 100nF
C4 C10 C11 C14 C15 C17 C18 C23 C24 C27-C29 C32-C34 C37-C39 C42-C44 C47-C49 C55 C71-C75 = C-EUC0603: CAPACITOR, European symbol; MANUFACTURER #: C0603C104K5RACTU; Manufacturer: Kemet; EE_SPEC: 0.1uF 50V capacitor
C5 C19-C21 = C-EUC0402: CAPACITOR, European symbol; MANUFACTURER #: GRM155R71C104KA88D; Manufacturer: Murata; EE_SPEC: 16V
C6-C9 C26 C52 = 100nF 0402 16V X7R: CAP CER 0402 100nF 16V 10% X7R; MANUFACTURER: Murata; MANUFACTURER #: GRM155R71C104KA88D; PART: 0.1uF 16V X7R 0402; PART DESCRIPTION: 0.10µF ±10% 16V Ceramic Capacitor X7R 0402 (1005 Metric); VALUE: 100nF; DISTRIBUTOR #: 490-3261-2-ND; DISTRIBUTOR: Digikey; TOLERANCE: 10%; EE_SPEC: 16V
C16 = C-EUC0603: CAPACITOR, European symbol; MANUFACTURER #: CC0603ZRY5V6BB105; Manufacturer: yageo; EE_SPEC: 1uF 10V capacitor
C25 C30 C45 = 10uF 1206 35V X5R: CAP CER 10UF 35V 10% X5R 1206; MANUFACTURER: Murata; MANUFACTURER #: GRM319R6YA106KA12D; PART: 10uF 35V X5R 1206; PART DESCRIPTION: 10µF ±10% 35V Ceramic Capacitor X5R 1206 (3216 Metric); DISTRIBUTOR #: 490-9964-2-ND; DISTRIBUTOR: Digikey; TOLERANCE: 10%; EE_SPEC: 35V; DNI: DNI; VALUE: 10uF
C31 C36 C41 C46 C51 = C-EUC0603: CAPACITOR, European symbol; MANUFACTURER #: CC0603KRX7R7BB224; Manufacturer: Yageo; EE_SPEC: 0.22uF 100V capacitor X or 15%
C35 = C-USC0603: CAPACITOR, American symbol; MANUFACTURER #: C1608X7R1E103K080AA; Manufacturer: TDK; EE_SPEC: 10nF (0.01uF) 25V capacitor
C40 = C-USC0805: CAPACITOR, American symbol; MANUFACTURER #: GRM21BR71H105KA12L; Manufacturer: Murata; EE_SPEC: Multilayer Ceramic Capacitors MLCC - SMD/SMT 1.0UF 50V 10% 0805
C63 = C-EUC0402: CAPACITOR, European symbol; MANUFACTURER #: CC0402KRX7R8BB472; EE_SPEC: Multilayer Ceramic Capacitors MLCC - SMD/SMT 4.7nF 25V X7R 10%
C76 = CPOL-USC12,5-5: POLARIZED CAPACITOR, American symbol; MANUFACTURER #: UPW1H471MHD1TO; Manufacturer: nichicon; EE_SPEC: CAPACITOR ALUM ELEC, 470UF, 50V, 20%, RADIAL
CF1-CF20 = NFM21C: EMIFIL(R) (Capacitor type) Single Circuit Type for Signal Lines   Source: http://search.murata.co.jp/Ceramy/image/img/PDF/ENG/L0111S0109NFM3DC.pdf; MPN: NFM21CC102R1H3D; MANUFACTURER #: NFM21CC223R1H3D; EE_SPEC: EMI Filter 2A 50VDC Flat Style SMD; OC_FARNELL: 1828795; OC_NEWARK: 84R0165
D1 D3 D6 D10 D20 = SCHOTTKY-DIODE: Schottky Diode; Manufacturer: Diodes Inc.; EE_SPEC: 3.0A 100V Diode; MANUFACTURER #: SK310A-TP
D4 D5 = DIODE-MINIMELF: DIODE; Manufacturer: Bourns; EE_SPEC: 100V 150mA diode; MANUFACTURER #: CD1206-S01575
D9 D21-D39 = SMAJ28A: TVS DIODE 28VWM 45.4VC SMA; Manufacturer: Diodes Inc; MANUFACTURER #: SMAJ28A-13-F; EE_SPEC: 28Vrs 45.4Vc; Tolerance: NA; DISTRIBUTOR #: SMAJ28A-FDITR-ND; DISTRIBUTOR: Digi-Key; PART: SMAJ28A; Part Description: TVS DIODE 28VWM 45.4VC SMA; VALUE: SMAJ28A
D11-D18 = BAT54WT-7: Diode Schottky 30V 100mA Surface Mount SOD-523; Manufacturer: Diodes Incorporated; EE_SPEC: 30V 0.1A; Tolerance: NA; Value: BAT54; MANUFACTURER #: BAT54WT-7; DISTRIBUTOR #: BAT54WT-7DI-ND; DISTRIBUTOR: Digi-Key; PART: BAT54; Part Description: Diode Schottky 30V 100mA Surface Mount SOD-523
D40 = TVS-BISOD323: DIODE   uni and bidirectional supressor diode; EE_SPEC: TVS DIODE 30VWM SOD323; MANUFACTURER #: RSB39VTE-17
F1 = L-EUL1812: INDUCTOR, European symbol; Manufacturer: Bourns; EE_SPEC: 500mA 15V fuse ptc reset; MANUFACTURER #: MF-MSMF050-2
JP2 = SJ: SMD solder JUMPER
JP3 X35-X38 = M02PTH: Header 2Standard 2-pin 0.1" header. Use with straight break away headers (SKU : PRT-00116), right angle break away headers (PRT-00553), swiss pins (PRT-00743), machine pins (PRT-00117), and female headers (PRT-00115). Molex polarized connector foot print use with SKU : PRT-08233 with associated crimp pins and housings.
L2 = L-US: INDUCTOR, American symbol; MANUFACTURER #: CBC2012T100M; Manufacturer: Taiyo Yuden; EE_SPEC: INDUCTOR 10UH 20% 0805 SMD
L3 = 10uH 1.7A: FIXED IND 33UH 1.7A 145 MOHM SMD; Manufacturer: Bourns; MANUFACTURER #: SRN8040-330M; Part Description: Semi-Shielded Wirewound Inductor 145 mOhm Max Nonstandard; Tolerance: +/- 20%; Value: 33uH; DISTRIBUTOR #: SRN8040-330M; DISTRIBUTOR: Digi-Key; EE_SPEC: FIXED IND 33UH 1.7A 145 MOHM SMD; PART: FIXED IND 33UH 1.7A 145 MOHM SMD
LED1 LED9 LED10 = LEDCHIP-LED0805: LED   OSRAM: - CHIPLED LG R971, LG N971, LY N971, LG Q971, LY Q971, LO R971, LY R971 LH N974, LH R974 LS Q976, LO Q976, LY Q976 LO Q996 - Hyper CHIPLED LW Q18S LB Q993, LB Q99A, LB R99A - SideLED LS A670, LO A670, LY A670, LG A670, LP A670 LB A673, LV A673, LT A673, LW A673 LH A674 LY A675 LS A676, LA A676, LO A676, LY A676, LW A676 LS A679, LY A679, LG A679 -  Hyper Micro SIDELED® LS Y876, LA Y876, LO Y876, LY Y876 LT Y87S - SmartLED LW L88C, LW L88S LB L89C, LB L89S, LG L890 LS L89K, LO L89K, LY L89K LS L896, LA L896, LO L896, LY L896 - TOPLED LS T670, LO T670, LY T670, LG T670, LP T670 LSG T670, LSP T670, LSY T670, LOP T670, LYG T670 LG T671, LOG T671, LSG T671 LB T673, LV T673, LT T673, LW T673 LH T674 LS T676, LA T676, LO T676, LY T676, LB T676, LH T676, LSB T676, LW T676 LB T67C, LV T67C, LT T67C, LS T67K, LO T67K, LY T67K, LW E67C LS E67B, LA E67B, LO E67B, LY E67B, LB E67C, LV E67C, LT E67C LW T67C LS T679, LY T679, LG T679 LS T770, LO T770, LY T770, LG T770, LP T770 LB T773, LV T773, LT T773, LW T773 LH T774 LS E675, LA E675, LY E675, LS T675 LS T776, LA T776, LO T776, LY T776, LB T776 LHGB T686 LT T68C, LB T68C - Hyper Mini TOPLED® LB M676 - Mini TOPLED Santana® LG M470 LS M47K, LO M47K, LY M47K    Source: http://www.osram.convergy.de   LUXEON: - LUMILED® LXK2-PW12-R00, LXK2-PW12-S00, LXK2-PW14-U00, LXK2-PW14-V00 LXK2-PM12-R00, LXK2-PM12-S00, LXK2-PM14-U00 LXK2-PE12-Q00, LXK2-PE12-R00, LXK2-PE12-S00, LXK2-PE14-T00, LXK2-PE14-U00 LXK2-PB12-K00, LXK2-PB12-L00, LXK2-PB12-M00, LXK2-PB14-N00, LXK2-PB14-P00, LXK2-PB14-Q00 LXK2-PR12-L00, LXK2-PR12-M00, LXK2-PR14-Q00, LXK2-PR14-R00 LXK2-PD12-Q00, LXK2-PD12-R00, LXK2-PD12-S00 LXK2-PH12-R00, LXK2-PH12-S00 LXK2-PL12-P00, LXK2-PL12-Q00, LXK2-PL12-R00    Source: www.luxeon.com   KINGBRIGHT:   KA-3528ASYC Source: www.kingbright.com; MANUFACTURER #: 5988140107F; Manufacturer: Dialight; EE_SPEC: YELLOW LED
LED2-LED6 LED8 = LEDCHIP-LED0805: LED   OSRAM: - CHIPLED LG R971, LG N971, LY N971, LG Q971, LY Q971, LO R971, LY R971 LH N974, LH R974 LS Q976, LO Q976, LY Q976 LO Q996 - Hyper CHIPLED LW Q18S LB Q993, LB Q99A, LB R99A - SideLED LS A670, LO A670, LY A670, LG A670, LP A670 LB A673, LV A673, LT A673, LW A673 LH A674 LY A675 LS A676, LA A676, LO A676, LY A676, LW A676 LS A679, LY A679, LG A679 -  Hyper Micro SIDELED® LS Y876, LA Y876, LO Y876, LY Y876 LT Y87S - SmartLED LW L88C, LW L88S LB L89C, LB L89S, LG L890 LS L89K, LO L89K, LY L89K LS L896, LA L896, LO L896, LY L896 - TOPLED LS T670, LO T670, LY T670, LG T670, LP T670 LSG T670, LSP T670, LSY T670, LOP T670, LYG T670 LG T671, LOG T671, LSG T671 LB T673, LV T673, LT T673, LW T673 LH T674 LS T676, LA T676, LO T676, LY T676, LB T676, LH T676, LSB T676, LW T676 LB T67C, LV T67C, LT T67C, LS T67K, LO T67K, LY T67K, LW E67C LS E67B, LA E67B, LO E67B, LY E67B, LB E67C, LV E67C, LT E67C LW T67C LS T679, LY T679, LG T679 LS T770, LO T770, LY T770, LG T770, LP T770 LB T773, LV T773, LT T773, LW T773 LH T774 LS E675, LA E675, LY E675, LS T675 LS T776, LA T776, LO T776, LY T776, LB T776 LHGB T686 LT T68C, LB T68C - Hyper Mini TOPLED® LB M676 - Mini TOPLED Santana® LG M470 LS M47K, LO M47K, LY M47K    Source: http://www.osram.convergy.de   LUXEON: - LUMILED® LXK2-PW12-R00, LXK2-PW12-S00, LXK2-PW14-U00, LXK2-PW14-V00 LXK2-PM12-R00, LXK2-PM12-S00, LXK2-PM14-U00 LXK2-PE12-Q00, LXK2-PE12-R00, LXK2-PE12-S00, LXK2-PE14-T00, LXK2-PE14-U00 LXK2-PB12-K00, LXK2-PB12-L00, LXK2-PB12-M00, LXK2-PB14-N00, LXK2-PB14-P00, LXK2-PB14-Q00 LXK2-PR12-L00, LXK2-PR12-M00, LXK2-PR14-Q00, LXK2-PR14-R00 LXK2-PD12-Q00, LXK2-PD12-R00, LXK2-PD12-S00 LXK2-PH12-R00, LXK2-PH12-S00 LXK2-PL12-P00, LXK2-PL12-Q00, LXK2-PL12-R00    Source: www.luxeon.com   KINGBRIGHT:   KA-3528ASYC Source: www.kingbright.com; MANUFACTURER #: 5988110107F; Manufacturer: Dialight; EE_SPEC: RED
LED7 = LEDCHIP-LED0805: LED   OSRAM: - CHIPLED LG R971, LG N971, LY N971, LG Q971, LY Q971, LO R971, LY R971 LH N974, LH R974 LS Q976, LO Q976, LY Q976 LO Q996 - Hyper CHIPLED LW Q18S LB Q993, LB Q99A, LB R99A - SideLED LS A670, LO A670, LY A670, LG A670, LP A670 LB A673, LV A673, LT A673, LW A673 LH A674 LY A675 LS A676, LA A676, LO A676, LY A676, LW A676 LS A679, LY A679, LG A679 -  Hyper Micro SIDELED® LS Y876, LA Y876, LO Y876, LY Y876 LT Y87S - SmartLED LW L88C, LW L88S LB L89C, LB L89S, LG L890 LS L89K, LO L89K, LY L89K LS L896, LA L896, LO L896, LY L896 - TOPLED LS T670, LO T670, LY T670, LG T670, LP T670 LSG T670, LSP T670, LSY T670, LOP T670, LYG T670 LG T671, LOG T671, LSG T671 LB T673, LV T673, LT T673, LW T673 LH T674 LS T676, LA T676, LO T676, LY T676, LB T676, LH T676, LSB T676, LW T676 LB T67C, LV T67C, LT T67C, LS T67K, LO T67K, LY T67K, LW E67C LS E67B, LA E67B, LO E67B, LY E67B, LB E67C, LV E67C, LT E67C LW T67C LS T679, LY T679, LG T679 LS T770, LO T770, LY T770, LG T770, LP T770 LB T773, LV T773, LT T773, LW T773 LH T774 LS E675, LA E675, LY E675, LS T675 LS T776, LA T776, LO T776, LY T776, LB T776 LHGB T686 LT T68C, LB T68C - Hyper Mini TOPLED® LB M676 - Mini TOPLED Santana® LG M470 LS M47K, LO M47K, LY M47K    Source: http://www.osram.convergy.de   LUXEON: - LUMILED® LXK2-PW12-R00, LXK2-PW12-S00, LXK2-PW14-U00, LXK2-PW14-V00 LXK2-PM12-R00, LXK2-PM12-S00, LXK2-PM14-U00 LXK2-PE12-Q00, LXK2-PE12-R00, LXK2-PE12-S00, LXK2-PE14-T00, LXK2-PE14-U00 LXK2-PB12-K00, LXK2-PB12-L00, LXK2-PB12-M00, LXK2-PB14-N00, LXK2-PB14-P00, LXK2-PB14-Q00 LXK2-PR12-L00, LXK2-PR12-M00, LXK2-PR14-Q00, LXK2-PR14-R00 LXK2-PD12-Q00, LXK2-PD12-R00, LXK2-PD12-S00 LXK2-PH12-R00, LXK2-PH12-S00 LXK2-PL12-P00, LXK2-PL12-Q00, LXK2-PL12-R00    Source: www.luxeon.com   KINGBRIGHT:   KA-3528ASYC Source: www.kingbright.com; MANUFACTURER #: 598-8170-107F; EE_SPEC: GREEN LED
Q1-Q3 Q5 = PSMN1R8-40YLC: MOSFET N-CH 40V 100A LFPAK; MANUFACTURER: Nexperia; MANUFACTURER #: PSMN1R8-40YLC,115; PART DESCRIPTION: N-Channel 40V 100A (Tc) 272W (Tc) Surface Mount LFPAK56, Power-SO8; TOLERANCE: -NA-; VALUE: N-FET; EE_SPEC: 40V 100A 1.8mOhm; DISTRIBUTOR #: 1727-1052-2-ND; DISTRIBUTOR: Digikey
Q4 = NCV8402AD: IC DVR LOW SIDE 8-SOIC; MANUFACTURER #: NCV8402ADDR2G; Manufacturer: On Semi; EE_SPEC: 42Vmaz 2A 0.165-Ohm; Tolerance: NA; DISTRIBUTOR #: NCV8402ADDR2GOSTR-ND; DISTRIBUTOR: Digi-Key; PART: NCV8402; Part Description: IC DVR LOW SIDE 8-SOIC; VALUE: NCV8402
R1 R2 R64 R74-R76 = R-US_R0402: RESISTOR, American symbol; MANUFACTURER #: RC0402FR-0722RL; Manufacturer: Yageo; EE_SPEC: 22R (22ohm) 62.5mW 1% resistor
R3 = R-US_R0603: RESISTOR, American symbol; MANUFACTURER #: CRCW0603470KFKEA; Manufacturer: Vishay; EE_SPEC: SMD 1/10watt 470Kohms 1% Thick Film Resistors
R4 R7 R8 R10 R14 R15 R19 R20 R23 R24 = R-US_R1206: RESISTOR, American symbol; MANUFACTURER #: CRM1206-FX-R100ELF; Manufacturer: Bourns; EE_SPEC: 0r1 (0.1ohm) .5mW 1% resistor
R11 R13 = R-US_R0603: RESISTOR, American symbol
R12 R17 R18 R22 R26 = R-US_R0603: RESISTOR, American symbol; MANUFACTURER #: CR0603J000ELF; Manufacturer: Bourns; EE_SPEC: 0r (zero ohm) 100mW 5% resistor
R27 R28 R32 R36 R38 R39 R77 R78 = RC0402FR-072K37L: RES SMD 2.37K OHM 1% 1/16W 0402; Manufacturer: Yageo; Part Description: 2.37k Ohm ±1% 0.063W, 1/16W Chip Resistor 0402 (1005 Metric) Moisture Resistant Thick Film; EE_SPEC: 2.37k 1% 0402; Tolerance: +/- 1%; VALUE: 2k37; MANUFACTURER #: RC0402FR-072K37L; DISTRIBUTOR #: 311-2.37KLRTR-ND; DISTRIBUTOR: Digi-Key; PART: 2.37k
R29 R65-R68 = R-US_R0603: RESISTOR, American symbol; MANUFACTURER #: CRCW060356R0JNEA; Manufacturer: Vishay; EE_SPEC: RESISTOR, THICK FILM, 56OHM, 100mW, 5%
R30 = R-US_R0603: RESISTOR, American symbol; MANUFACTURER #: erj3geyj332v; Manufacturer: panasonic; EE_SPEC: RESISTOR, THICK FILM, 3.3KOHM, 100mW, 5%
R31 R37 R73 R79 = RC0402FR-074K7L: RES SMD 4.7K OHM 1% 1/16W 0402; Manufacturer: Yageo; Part Description: 4.7k Ohm ±1% 0.063W, 1/16W Chip Resistor 0402 (1005 Metric) Moisture Resistant Thick Film; EE_SPEC: 4.7k 1% 0402; Tolerance: +/- 1%; VALUE: 4.7k; MANUFACTURER #: RC0402FR-074K7L; DISTRIBUTOR #: 311-4.7KLRTR-ND; DISTRIBUTOR: Digi-Key; PART: 4.7k
R33-R35 = R-US_R0603: RESISTOR, American symbol; MANUFACTURER #: ERJ-3EKF1001V; Manufacturer: Panasonic; EE_SPEC: RESISTOR, THICK FILM, 1KOHM, 100mW, 1%
R40 R41 R50 R55 R58 R69 = R-US_R0603: RESISTOR, American symbol; MANUFACTURER #: RC0603JR-071K8L; EE_SPEC: Resistor, Thick Film, 1.8K Ohm, 50V, 5±%, 100ppm, 0603 Case Size
R42 R48 R51 R53 R56 R70 = 100R 1% 0402: RES SMD 100 OHM 1% 1/16W 0402; MANUFACTURER: Yageo; MANUFACTURER #: RC0402FR-07100RL; PART DESCRIPTION: 100 Ohm ±1% 0.063W, 1/16W Chip Resistor 0402 (1005 Metric) Moisture Resistant Thick Film; DISTRIBUTOR #: 311-100LRTR-ND; DISTRIBUTOR: Digikey; PART: 100R 1% 0402; TOLERANCE: 1%; EE_SPEC: 1/16W; VALUE: 100R
R43 R49 R52 R54 R57 R59-R63 R71 = R-US_R0603: RESISTOR, American symbol; MANUFACTURER #: RC0603FR-07100KL; Manufacturer: Yageo; EE_SPEC: 100Kohm 100mW 1% resistor
R46 R47 = R-US_R0603: RESISTOR, American symbol; MANUFACTURER #: ERJ-3EKF1002V; Manufacturer: Panasonic; EE_SPEC: 10Kohm 100mW 1% resistor
R72 = R-US_R0402: RESISTOR, American symbol; MANUFACTURER #: ERJ2GEJ105X; Manufacturer: Panasonic; EE_SPEC: RES 1M OHM 1/10W 5% 0402 SMD
RN5 = 4R-NCAY16: RES ARRAY 4 RES 1K OHM 1206; MANUFACTURER #: CAY16-102J4LF; Manufacturer: Bourns; EE_SPEC: 1k Ohm ±5% 62.5mW Power Per Element Isolated 4 Resistor Network/Array ±200ppm/°C 1206 (3216 Metric), Convex, Long Side Terminals; OC_FARNELL: unknown; OC_NEWARK: unknown
S1 = 31-XX: OMRON SWITCHNow with beefier pads!; MANUFACTURER #: 1571610-2; EE_SPEC: SWITCH, TACTILE, SPST-NO, 50mA, THD; Manufacturer: Omron
TP0-TP19 = PTR1B1,27TH: TEST PIN
TP20-TP23 = PTR1B1,27: TEST PIN
U1 = ATMEGA16U2-MU2: MANUFACTURER #: ATMEGA32U2MU; Manufacturer: Atmel; EE_SPEC: ATMEGA32U2-MUR (IC)
U2 = ATMEGA2560AU: Manufacturer: Microchip; MANUFACTURER #: ATMEGA2560-16AUR; Part Description: AVR AVR® ATmega Microcontroller IC 8-Bit 16MHz 256KB (128K x 16) FLASH 100-TQFP (14x14); EE_SPEC: 5V 256KB 8KB 16MHz; Tolerance: NA; DISTRIBUTOR #: ATMEGA2560-16AURTR-ND; DISTRIBUTOR: Digi-Key; PART: ATMEGA2560; VALUE: ATMEGA2560
U3 = LM22675: EE_SPEC: IC REG BUCK 5V 1A 8SOPWRPAD; MANUFACTURER #: LM22675
U4 = AD5206: MANUFACTURER #: AD5206BRUZ10-RL7; Manufacturer: Analog Devices; EE_SPEC: AD5206 (IC)
U5-U9 = A4982QFN32ROUNDPADS: MANUFACTURER #: A4982SETTR-T; Manufacturer: Allegro; EE_SPEC: A4982
U10 = ADUM7441: MANUFACTURER #: ADUM7441ARQZ-RL7; Manufacturer: Analog Devices; EE_SPEC: ADUM7441
X2 = PN61729: BERG USB connector; MANUFACTURER #: 61729-0010BLF; Manufacturer: FCI; EE_SPEC: USB B-TH connector
X3 X9 X27-X29 = C-GRID-02-70543: CONNECTOR   wire to board 2.54 mm (0.100") pitch header; MANUFACTURER #: 70543-0001; Manufacturer: Molex; EE_SPEC: WIRE-BOARD CONNECTOR HEADER 2POS, 2.54MM; OC_FARNELL: unknown; OC_NEWARK: unknown
X4 X6-X8 X14 X15 = MPT4: PHOENIX CONNECTOR; MANUFACTURER #: 70543-0038; Manufacturer: Molex; EE_SPEC: WIRE-BOARD CONNECTOR HEADER 4POS, 2.54MM; OC_FARNELL: unknown; OC_NEWARK: unknown
X11 = MSTBV10: PHOENIX; MPN: MSTBV 2,5/10-GF-5.08; MANUFACTURER #: 395311010; Manufacturer: Molex; EE_SPEC: CONN HEADER 10POS 5.08MM STR TIN; OC_FARNELL: 1792798; OC_NEWARK: 69R9844
X16 = M08X2
X17 = PINHD-2X3: PIN HEADER; MANUFACTURER #: 2213S-06G; EE_SPEC: 2x3 header
X40 = M04X2: MANUFACTURER #: 2213S-08G
Y1 Y2 = CRYSTAL-3.2-2.5: MANUFACTURER #: 7M-16.000MEEQ-T; Manufacturer: TXC; EE_SPEC: 16MHz KX-7 10ppm crystal
Z1-Z3 = R-US_R0603: RESISTOR, American symbol; Manufacturer: Bourns; EE_SPEC: 5V 20V varistor; MANUFACTURER #: CG0603MLC-05E